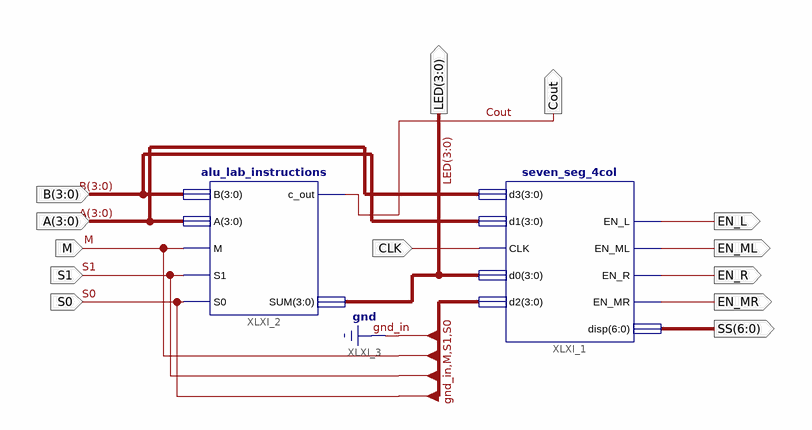
[diagram p0: schematic sheet 1]
// Xilinx ISE schematic main_lab.sch (spartan3e) as structural Verilog: 2 symbols, 13 ports
module main_lab (
  input  [3:0] A,
  input  M,
  input  S1,
  input  S0,
  input  CLK,
  input  [3:0] B,
  output [6:0] SS,
  output EN_MR,
  output EN_R,
  output EN_ML,
  output EN_L,
  output [3:0] LED,
  output Cout
);

  seven_seg_4col XLXI_1 (
    .d3(A), .d1(B), .CLK(CLK), .d0(LED), .d2({1'b0, M, S1, S0}), .disp(SS), .EN_L(EN_L), .EN_ML(EN_ML),
    .EN_R(EN_R), .EN_MR(EN_MR));
  alu_lab_instructions XLXI_2 (.B(B), .A(A), .M(M), .S1(S1), .S0(S0), .c_out(Cout), .SUM(LED));
endmodule
